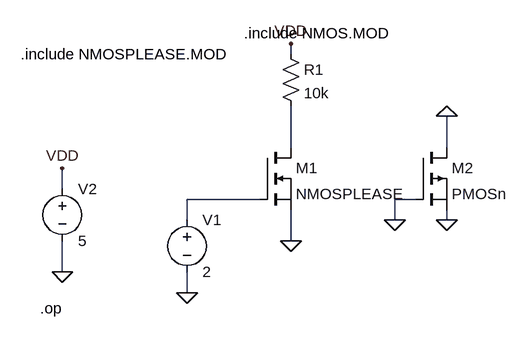
[diagram p0: schematic Draft1.asc]
Draft1.asc, the LTspice schematic file:
Version 4
SHEET 1 1104 680
WIRE 768 208 768 192
WIRE 768 352 768 288
WIRE 1008 352 1008 304
WIRE 416 416 416 384
WIRE 720 432 608 432
WIRE 960 432 928 432
WIRE 608 464 608 432
WIRE 928 464 928 432
WIRE 1008 464 1008 448
WIRE 768 496 768 448
WIRE 416 544 416 496
WIRE 608 576 608 544
FLAG 416 384 VDD
FLAG 416 544 0
FLAG 608 576 0
FLAG 768 496 0
FLAG 768 192 VDD
FLAG 928 464 0
FLAG 1008 464 0
FLAG 1008 304 0
SYMBOL /nmos 720 352 R0
SYMATTR InstName M1
SYMATTR Value NMOSPLEASE
SYMBOL /pmos 960 352 R0
SYMATTR InstName M2
SYMATTR Value PMOSn
<<<<<<< HEAD
TEXT 696 176 Left 2 !.include NMOS.MOD
=======
SYMBOL voltage 608 448 R0
SYMATTR InstName V1
SYMATTR Value 2
SYMBOL res 752 192 R0
SYMATTR InstName R1
SYMATTR Value 10k
SYMBOL voltage 416 400 R0
SYMATTR InstName V2
SYMATTR Value 5
TEXT 382 600 Left 2 !.op
TEXT 352 208 Left 2 !.include NMOSPLEASE.MOD
>>>>>>> 317aef3a4b1b9eb9ab1213dcc67f53a8ff66aa39

The netlist it stands for:
* Draft1.asc
M1 N001 N002 0 0 NMOSPLEASE
M2 0 0 0 0 PMOSn
V1 N002 0 2
R1 VDD N001 10k
V2 VDD 0 5
.model NMOS NMOS
.model PMOS PMOS
.lib standard.mos
.include NMOS.MOD
.op
.include NMOSPLEASE.MOD
.backanno
.end